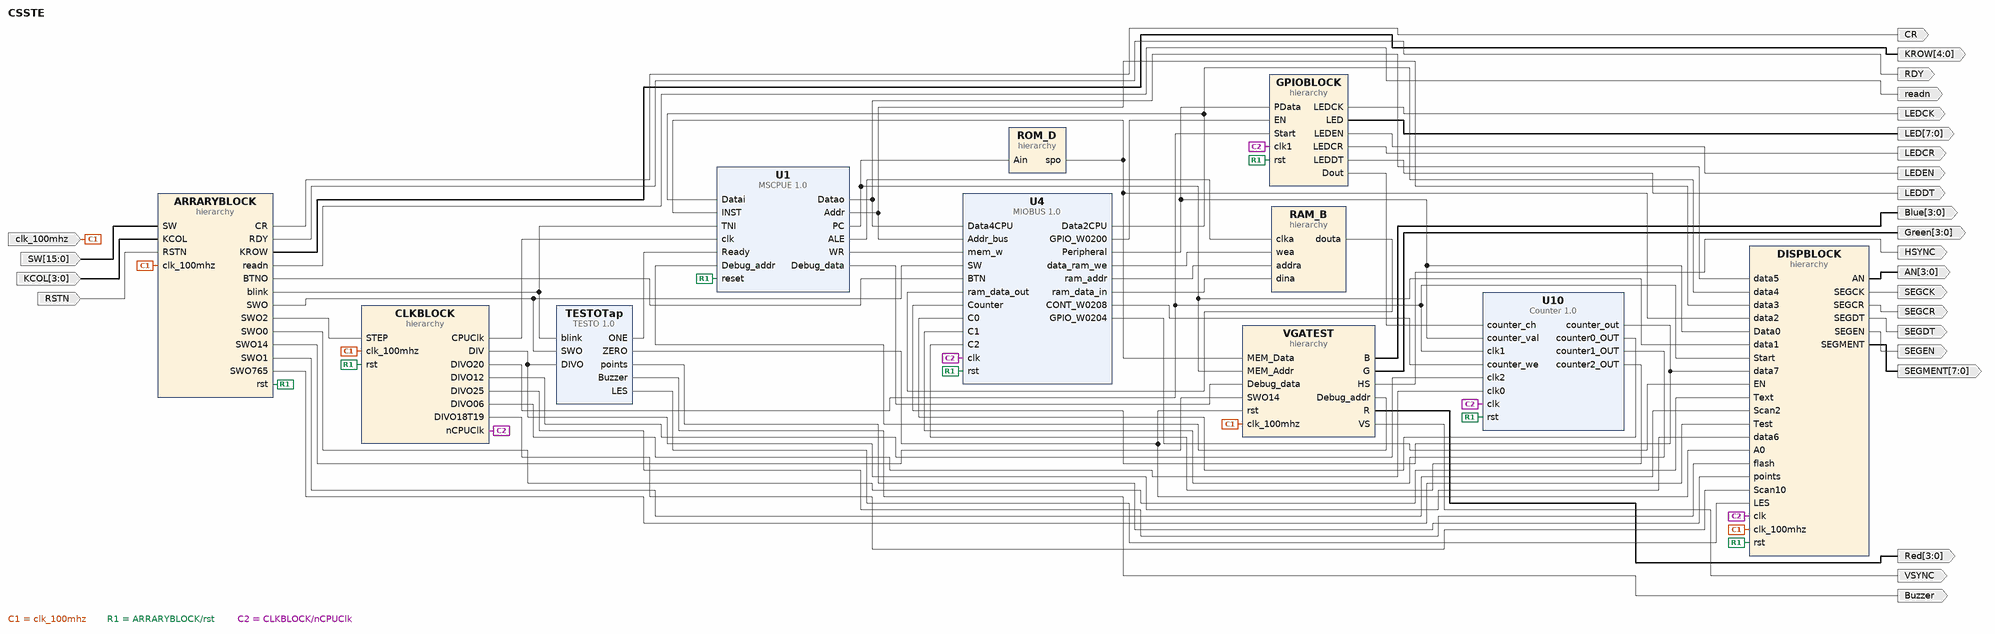
[diagram p0: block diagram of the top level]
# Vivado block design CSSTE, xc7k160tffg676-2L, Vivado 2017.4
create_bd_design CSSTE

create_bd_port -dir O CR
create_bd_port -dir O RDY
create_bd_port -dir I -from 15 -to 0 SW
create_bd_port -dir I -type clk clk_100mhz
create_bd_port -dir I -from 3 -to 0 KCOL
create_bd_port -dir O -from 4 -to 0 KROW
create_bd_port -dir I RSTN
create_bd_port -dir O readn
create_bd_port -dir O SEGEN
create_bd_port -dir O SEGCK
create_bd_port -dir O SEGCR
create_bd_port -dir O SEGDT
create_bd_port -dir O -from 3 -to 0 AN
create_bd_port -dir O -from 7 -to 0 SEGMENT
create_bd_port -dir O LEDEN
create_bd_port -dir O LEDCK
create_bd_port -dir O LEDCR
create_bd_port -dir O LEDDT
create_bd_port -dir O -from 7 -to 0 LED
create_bd_port -dir O -from 3 -to 0 Blue
create_bd_port -dir O -from 3 -to 0 Green
create_bd_port -dir O HSYNC
create_bd_port -dir O -from 3 -to 0 Red
create_bd_port -dir O VSYNC
create_bd_port -dir O Buzzer

create_bd_cell -type ip -vlnv ZJUCLIP:user:MSCPUE:1.0 U1
create_bd_cell -type ip -vlnv ZJUCLIP:user:MIOBUS:1.0 U4
create_bd_cell -type hier ARRARYBLOCK
create_bd_cell -type hier CLKBLOCK
create_bd_cell -type hier DISPBLOCK
create_bd_cell -type hier GPIOBLOCK
create_bd_cell -type hier ROM_D
create_bd_cell -type hier RAM_B
create_bd_cell -type ip -vlnv ZJUCLIP:user:TESTO:1.0 TESTOTap
create_bd_cell -type hier VGATEST
create_bd_cell -type ip -vlnv ZJUCLIP:user:Counter:1.0 U10

# ---- hierarchy /ARRARYBLOCK ----
current_bd_instance /ARRARYBLOCK
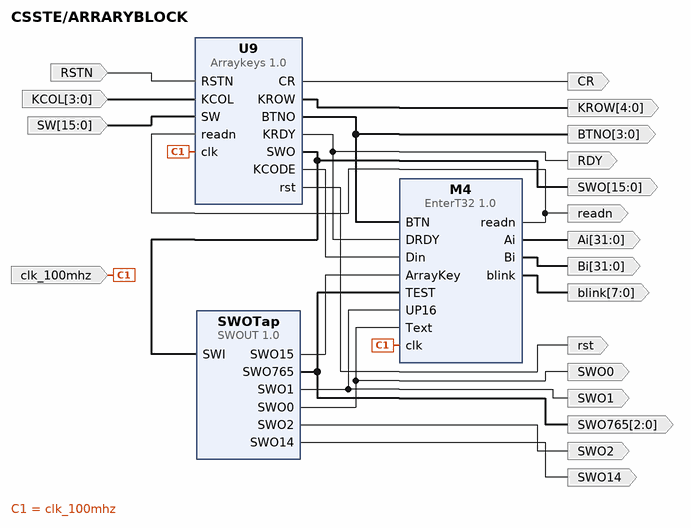
[diagram p1: block diagram inside /ARRARYBLOCK]
create_bd_pin -dir I -type clk clk_100mhz
create_bd_pin -dir I RSTN
create_bd_pin -dir O readn
create_bd_pin -dir I -from 3 -to 0 KCOL
create_bd_pin -dir O -from 4 -to 0 KROW
create_bd_pin -dir I -from 15 -to 0 SW
create_bd_pin -dir O RDY
create_bd_pin -dir O -from 3 -to 0 BTNO
create_bd_pin -dir O -from 15 -to 0 SWO
create_bd_pin -dir O CR
create_bd_pin -dir O rst
create_bd_pin -dir O -from 2 -to 0 SWO765
create_bd_pin -dir O SWO1
create_bd_pin -dir O SWO0
create_bd_pin -dir O -from 31 -to 0 Ai
create_bd_pin -dir O -from 31 -to 0 Bi
create_bd_pin -dir O -from 7 -to 0 blink
create_bd_pin -dir O SWO14
create_bd_pin -dir O SWO2

create_bd_cell -type ip -vlnv ZJUCLIP:user:Arraykeys:1.0 U9
create_bd_cell -type ip -vlnv ZJUCLIP:user:EnterT32:1.0 M4
create_bd_cell -type ip -vlnv ZJUCLIP:user:SWOUT:1.0 SWOTap

# ---- hierarchy /CLKBLOCK ----
current_bd_instance /CLKBLOCK
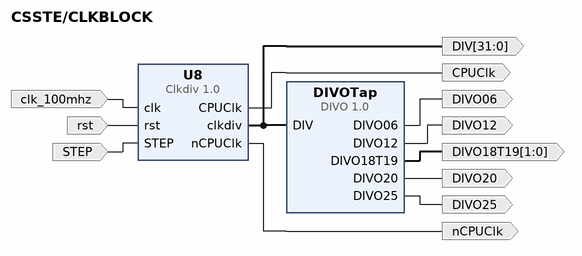
[diagram p2: block diagram inside /CLKBLOCK]
create_bd_pin -dir I -type clk clk_100mhz
create_bd_pin -dir I -type rst rst
create_bd_pin -dir I STEP
create_bd_pin -dir O -from 31 -to 0 DIV
create_bd_pin -dir O CPUClk
create_bd_pin -dir O nCPUClk
create_bd_pin -dir O DIVO25
create_bd_pin -dir O DIVO20
create_bd_pin -dir O -from 1 -to 0 DIVO18T19
create_bd_pin -dir O DIVO12
create_bd_pin -dir O DIVO06

create_bd_cell -type ip -vlnv ZJUCLIP:user:Clkdiv:1.0 U8
create_bd_cell -type ip -vlnv ZJUCLIP:user:DIVO:1.0 DIVOTap

# ---- hierarchy /DISPBLOCK ----
current_bd_instance /DISPBLOCK
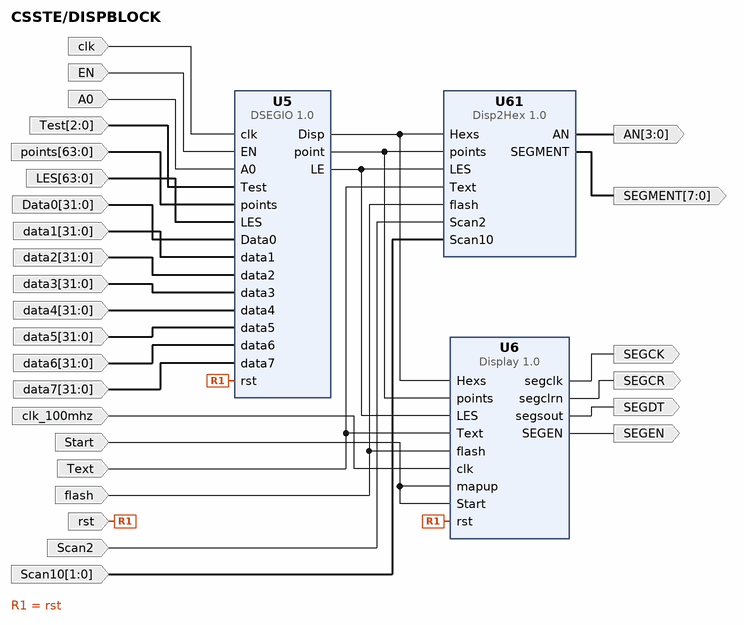
[diagram p3: block diagram inside /DISPBLOCK]
create_bd_pin -dir I clk
create_bd_pin -dir I rst
create_bd_pin -dir I EN
create_bd_pin -dir I A0
create_bd_pin -dir I -from 2 -to 0 Test
create_bd_pin -dir I -from 63 -to 0 points
create_bd_pin -dir I -from 63 -to 0 LES
create_bd_pin -dir I -from 31 -to 0 Data0
create_bd_pin -dir I -from 31 -to 0 data1
create_bd_pin -dir I -from 31 -to 0 data2
create_bd_pin -dir I -from 31 -to 0 data3
create_bd_pin -dir I -from 31 -to 0 data4
create_bd_pin -dir I -from 31 -to 0 data5
create_bd_pin -dir I -from 31 -to 0 data6
create_bd_pin -dir I -from 31 -to 0 data7
create_bd_pin -dir I -type clk clk_100mhz
create_bd_pin -dir I Start
create_bd_pin -dir I Text
create_bd_pin -dir I flash
create_bd_pin -dir O SEGCK
create_bd_pin -dir O SEGDT
create_bd_pin -dir O SEGEN
create_bd_pin -dir O SEGCR
create_bd_pin -dir I Scan2
create_bd_pin -dir I -from 1 -to 0 Scan10
create_bd_pin -dir O -from 3 -to 0 AN
create_bd_pin -dir O -from 7 -to 0 SEGMENT

create_bd_cell -type ip -vlnv ZJUCLIP:user:DSEGIO:1.0 U5
create_bd_cell -type ip -vlnv ZJUCLIP:user:Display:1.0 U6
create_bd_cell -type ip -vlnv ZJUCLIP:user:Disp2Hex:1.0 U61

# ---- hierarchy /GPIOBLOCK ----
current_bd_instance /GPIOBLOCK
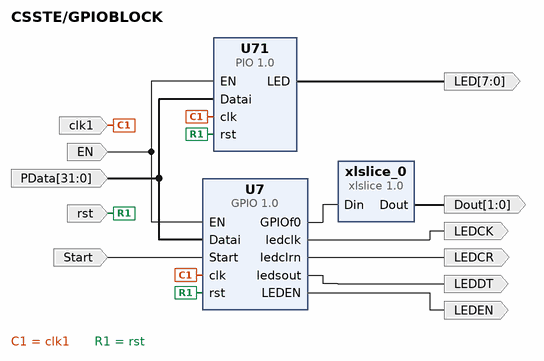
[diagram p4: block diagram inside /GPIOBLOCK]
create_bd_pin -dir I clk1
create_bd_pin -dir I rst
create_bd_pin -dir I EN
create_bd_pin -dir I -from 31 -to 0 PData
create_bd_pin -dir O -from 7 -to 0 LED
create_bd_pin -dir I Start
create_bd_pin -dir O LEDCK
create_bd_pin -dir O LEDDT
create_bd_pin -dir O LEDCR
create_bd_pin -dir O LEDEN
create_bd_pin -dir O -from 1 -to 0 Dout

create_bd_cell -type ip -vlnv ZJUCLIP:user:PIO:1.0 U71
create_bd_cell -type ip -vlnv ZJUCLIP:user:GPIO:1.0 U7
create_bd_cell -type ip -vlnv xilinx.com:ip:xlslice:1.0 xlslice_0
set_property -dict {CONFIG.DIN_TO 0 CONFIG.DIN_FROM 1 CONFIG.DIN_WIDTH 16 CONFIG.DOUT_WIDTH 2} [get_bd_cells xlslice_0]

# ---- hierarchy /ROM_D ----
current_bd_instance /ROM_D
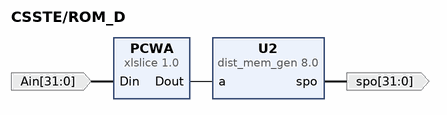
[diagram p5: block diagram inside /ROM_D]
create_bd_pin -dir I -from 31 -to 0 Ain
create_bd_pin -dir O -from 31 -to 0 spo

create_bd_cell -type ip -vlnv xilinx.com:ip:xlslice:1.0 PCWA
set_property -dict {CONFIG.DIN_TO 2 CONFIG.DIN_FROM 11 CONFIG.DOUT_WIDTH 10} [get_bd_cells PCWA]
create_bd_cell -type ip -vlnv xilinx.com:ip:dist_mem_gen:8.0 U2
set_property -dict [list \
  CONFIG.depth 1024 \
  CONFIG.data_width 32 \
  CONFIG.memory_type rom \
  CONFIG.coefficient_file ../../../../../../coe/MSCPUE31_sign.coe \
] [get_bd_cells U2]

# ---- hierarchy /RAM_B ----
current_bd_instance /RAM_B
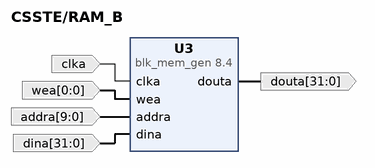
[diagram p6: block diagram inside /RAM_B]
create_bd_pin -dir I -type clk clka
create_bd_pin -dir I -from 0 -to 0 wea
create_bd_pin -dir I -from 9 -to 0 addra
create_bd_pin -dir I -from 31 -to 0 dina
create_bd_pin -dir O -from 31 -to 0 douta

create_bd_cell -type ip -vlnv xilinx.com:ip:blk_mem_gen:8.4 U3
set_property -dict [list \
  CONFIG.Enable_32bit_Address false \
  CONFIG.Use_Byte_Write_Enable false \
  CONFIG.Write_Depth_A 1024 \
  CONFIG.Enable_A Always_Enabled \
  CONFIG.Register_PortA_Output_of_Memory_Primitives false \
  CONFIG.Load_Init_File true \
  CONFIG.Coe_File ../../../../../../coe/D_mem.coe \
  CONFIG.Use_RSTA_Pin false \
  CONFIG.use_bram_block Stand_Alone \
] [get_bd_cells U3]

# ---- hierarchy /VGATEST ----
current_bd_instance /VGATEST
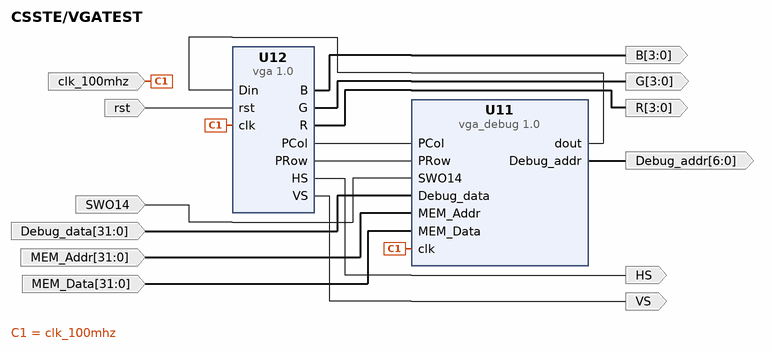
[diagram p7: block diagram inside /VGATEST]
create_bd_pin -dir I -type clk clk_100mhz
create_bd_pin -dir I SWO14
create_bd_pin -dir I -from 31 -to 0 Debug_data
create_bd_pin -dir I -from 31 -to 0 MEM_Addr
create_bd_pin -dir I -from 31 -to 0 MEM_Data
create_bd_pin -dir O -from 6 -to 0 Debug_addr
create_bd_pin -dir I -type rst rst
create_bd_pin -dir O -from 3 -to 0 R
create_bd_pin -dir O -from 3 -to 0 G
create_bd_pin -dir O -from 3 -to 0 B
create_bd_pin -dir O HS
create_bd_pin -dir O VS

create_bd_cell -type ip -vlnv ZJUCLIP:user:vga_debug:1.0 U11
create_bd_cell -type ip -vlnv ZJUCLIP:user:vga:1.0 U12

# ---- connections ----

current_bd_instance /ARRARYBLOCK
connect_bd_net [get_bd_pins U9/KCODE] [get_bd_pins M4/Din]
connect_bd_net [get_bd_pins SWOTap/SWO15] [get_bd_pins M4/ArrayKey]
connect_bd_net -net clk_0_1 [get_bd_pins clk_100mhz] [get_bd_pins M4/clk] [get_bd_pins U9/clk]
connect_bd_net -net RSTN_0_1 [get_bd_pins RSTN] [get_bd_pins U9/RSTN]
connect_bd_net [get_bd_pins M4/readn] [get_bd_pins readn] [get_bd_pins U9/readn]
connect_bd_net -net KCOL_0_1 [get_bd_pins KCOL] [get_bd_pins U9/KCOL]
connect_bd_net [get_bd_pins U9/KROW] [get_bd_pins KROW]
connect_bd_net -net SW_0_1 [get_bd_pins SW] [get_bd_pins U9/SW]
connect_bd_net [get_bd_pins U9/KRDY] [get_bd_pins RDY] [get_bd_pins M4/DRDY]
connect_bd_net [get_bd_pins U9/BTNO] [get_bd_pins BTNO] [get_bd_pins M4/BTN]
connect_bd_net [get_bd_pins U9/SWO] [get_bd_pins SWO] [get_bd_pins SWOTap/SWI]
connect_bd_net [get_bd_pins U9/CR] [get_bd_pins CR]
connect_bd_net [get_bd_pins U9/rst] [get_bd_pins rst]
connect_bd_net [get_bd_pins SWOTap/SWO765] [get_bd_pins SWO765] [get_bd_pins M4/TEST]
connect_bd_net [get_bd_pins SWOTap/SWO1] [get_bd_pins SWO1] [get_bd_pins M4/UP16]
connect_bd_net [get_bd_pins SWOTap/SWO0] [get_bd_pins SWO0] [get_bd_pins M4/Text]
connect_bd_net [get_bd_pins M4/Ai] [get_bd_pins Ai]
connect_bd_net [get_bd_pins M4/Bi] [get_bd_pins Bi]
connect_bd_net [get_bd_pins M4/blink] [get_bd_pins blink]
connect_bd_net [get_bd_pins SWOTap/SWO14] [get_bd_pins SWO14]
connect_bd_net [get_bd_pins SWOTap/SWO2] [get_bd_pins SWO2]

current_bd_instance /CLKBLOCK
connect_bd_net -net clk_0_2 [get_bd_pins clk_100mhz] [get_bd_pins U8/clk]
connect_bd_net -net rst_0_1 [get_bd_pins rst] [get_bd_pins U8/rst]
connect_bd_net -net STEP_0_1 [get_bd_pins STEP] [get_bd_pins U8/STEP]
connect_bd_net [get_bd_pins U8/clkdiv] [get_bd_pins DIV] [get_bd_pins DIVOTap/DIV]
connect_bd_net [get_bd_pins U8/CPUClk] [get_bd_pins CPUClk]
connect_bd_net [get_bd_pins U8/nCPUClk] [get_bd_pins nCPUClk]
connect_bd_net [get_bd_pins DIVOTap/DIVO25] [get_bd_pins DIVO25]
connect_bd_net [get_bd_pins DIVOTap/DIVO20] [get_bd_pins DIVO20]
connect_bd_net [get_bd_pins DIVOTap/DIVO18T19] [get_bd_pins DIVO18T19]
connect_bd_net [get_bd_pins DIVOTap/DIVO12] [get_bd_pins DIVO12]
connect_bd_net [get_bd_pins DIVOTap/DIVO06] [get_bd_pins DIVO06]

current_bd_instance /DISPBLOCK
connect_bd_net [get_bd_pins U5/Disp] [get_bd_pins U61/Hexs] [get_bd_pins U6/Hexs]
connect_bd_net [get_bd_pins U5/point] [get_bd_pins U61/points] [get_bd_pins U6/points]
connect_bd_net [get_bd_pins U5/LE] [get_bd_pins U61/LES] [get_bd_pins U6/LES]
connect_bd_net -net clk_1_1 [get_bd_pins clk] [get_bd_pins U5/clk]
connect_bd_net -net rst_1_1 [get_bd_pins rst] [get_bd_pins U6/rst] [get_bd_pins U5/rst]
connect_bd_net -net EN_0_1 [get_bd_pins EN] [get_bd_pins U5/EN]
connect_bd_net -net A0_0_1 [get_bd_pins A0] [get_bd_pins U5/A0]
connect_bd_net -net Test_0_1 [get_bd_pins Test] [get_bd_pins U5/Test]
connect_bd_net -net points_0_1 [get_bd_pins points] [get_bd_pins U5/points]
connect_bd_net -net LES_0_1 [get_bd_pins LES] [get_bd_pins U5/LES]
connect_bd_net -net Data0_0_1 [get_bd_pins Data0] [get_bd_pins U5/Data0]
connect_bd_net -net data1_0_1 [get_bd_pins data1] [get_bd_pins U5/data1]
connect_bd_net -net data2_0_1 [get_bd_pins data2] [get_bd_pins U5/data2]
connect_bd_net -net data3_0_1 [get_bd_pins data3] [get_bd_pins U5/data3]
connect_bd_net -net data4_0_1 [get_bd_pins data4] [get_bd_pins U5/data4]
connect_bd_net -net data5_0_1 [get_bd_pins data5] [get_bd_pins U5/data5]
connect_bd_net -net data6_0_1 [get_bd_pins data6] [get_bd_pins U5/data6]
connect_bd_net -net data7_0_1 [get_bd_pins data7] [get_bd_pins U5/data7]
connect_bd_net -net clk_2_1 [get_bd_pins clk_100mhz] [get_bd_pins U6/clk]
connect_bd_net -net Start_0_1 [get_bd_pins Start] [get_bd_pins U6/mapup] [get_bd_pins U6/Start]
connect_bd_net -net Text_0_1 [get_bd_pins Text] [get_bd_pins U61/Text] [get_bd_pins U6/Text]
connect_bd_net -net flash_0_1 [get_bd_pins flash] [get_bd_pins U61/flash] [get_bd_pins U6/flash]
connect_bd_net [get_bd_pins U6/segclk] [get_bd_pins SEGCK]
connect_bd_net [get_bd_pins U6/segsout] [get_bd_pins SEGDT]
connect_bd_net [get_bd_pins U6/SEGEN] [get_bd_pins SEGEN]
connect_bd_net [get_bd_pins U6/segclrn] [get_bd_pins SEGCR]
connect_bd_net -net Scan2_0_1 [get_bd_pins Scan2] [get_bd_pins U61/Scan2]
connect_bd_net -net Scan10_0_1 [get_bd_pins Scan10] [get_bd_pins U61/Scan10]
connect_bd_net [get_bd_pins U61/AN] [get_bd_pins AN]
connect_bd_net [get_bd_pins U61/SEGMENT] [get_bd_pins SEGMENT]

current_bd_instance /GPIOBLOCK
connect_bd_net [get_bd_pins U7/GPIOf0] [get_bd_pins xlslice_0/Din]
connect_bd_net -net clk_3_1 [get_bd_pins clk1] [get_bd_pins U7/clk] [get_bd_pins U71/clk]
connect_bd_net -net rst_2_1 [get_bd_pins rst] [get_bd_pins U7/rst] [get_bd_pins U71/rst]
connect_bd_net -net EN_1_1 [get_bd_pins EN] [get_bd_pins U7/EN] [get_bd_pins U71/EN]
connect_bd_net -net Datai_0_1 [get_bd_pins PData] [get_bd_pins U7/Datai] [get_bd_pins U71/Datai]
connect_bd_net [get_bd_pins U71/LED] [get_bd_pins LED]
connect_bd_net -net Start_0_2 [get_bd_pins Start] [get_bd_pins U7/Start]
connect_bd_net [get_bd_pins U7/ledclk] [get_bd_pins LEDCK]
connect_bd_net [get_bd_pins U7/ledsout] [get_bd_pins LEDDT]
connect_bd_net [get_bd_pins U7/ledclrn] [get_bd_pins LEDCR]
connect_bd_net [get_bd_pins U7/LEDEN] [get_bd_pins LEDEN]
connect_bd_net [get_bd_pins xlslice_0/Dout] [get_bd_pins Dout]

current_bd_instance /ROM_D
connect_bd_net [get_bd_pins PCWA/Dout] [get_bd_pins U2/a]
connect_bd_net -net Din_0_1 [get_bd_pins Ain] [get_bd_pins PCWA/Din]
connect_bd_net -net ROM_D_spo [get_bd_pins U2/spo] [get_bd_pins spo]

current_bd_instance /RAM_B
connect_bd_net -net clka_0_1 [get_bd_pins clka] [get_bd_pins U3/clka]
connect_bd_net -net wea_0_1 [get_bd_pins wea] [get_bd_pins U3/wea]
connect_bd_net -net addra_0_1 [get_bd_pins addra] [get_bd_pins U3/addra]
connect_bd_net -net dina_0_1 [get_bd_pins dina] [get_bd_pins U3/dina]
connect_bd_net -net RAM_B_douta [get_bd_pins U3/douta] [get_bd_pins douta]

current_bd_instance /VGATEST
connect_bd_net [get_bd_pins U12/PCol] [get_bd_pins U11/PCol]
connect_bd_net [get_bd_pins U12/PRow] [get_bd_pins U11/PRow]
connect_bd_net [get_bd_pins U11/dout] [get_bd_pins U12/Din]
connect_bd_net -net clk_4_1 [get_bd_pins clk_100mhz] [get_bd_pins U12/clk] [get_bd_pins U11/clk]
connect_bd_net -net SWO14_0_1 [get_bd_pins SWO14] [get_bd_pins U11/SWO14]
connect_bd_net -net Debug_data_0_1 [get_bd_pins Debug_data] [get_bd_pins U11/Debug_data]
connect_bd_net -net MEM_Addr_0_1 [get_bd_pins MEM_Addr] [get_bd_pins U11/MEM_Addr]
connect_bd_net -net MEM_Data_0_1 [get_bd_pins MEM_Data] [get_bd_pins U11/MEM_Data]
connect_bd_net [get_bd_pins U11/Debug_addr] [get_bd_pins Debug_addr]
connect_bd_net -net rst_3_1 [get_bd_pins rst] [get_bd_pins U12/rst]
connect_bd_net [get_bd_pins U12/R] [get_bd_pins R]
connect_bd_net [get_bd_pins U12/G] [get_bd_pins G]
connect_bd_net [get_bd_pins U12/B] [get_bd_pins B]
connect_bd_net [get_bd_pins U12/HS] [get_bd_pins HS]
connect_bd_net [get_bd_pins U12/VS] [get_bd_pins VS]

current_bd_instance /
connect_bd_net -net U9_CR [get_bd_pins ARRARYBLOCK/CR] [get_bd_ports CR]
connect_bd_net -net U9_KRDY [get_bd_pins ARRARYBLOCK/RDY] [get_bd_ports RDY]
connect_bd_net -net SW_0_1 [get_bd_ports SW] [get_bd_pins ARRARYBLOCK/SW]
connect_bd_net -net clk_0_1 [get_bd_ports clk_100mhz] \
  [get_bd_pins ARRARYBLOCK/clk_100mhz] [get_bd_pins CLKBLOCK/clk_100mhz] [get_bd_pins VGATEST/clk_100mhz] \
  [get_bd_pins DISPBLOCK/clk_100mhz]
connect_bd_net -net KCOL_0_1 [get_bd_ports KCOL] [get_bd_pins ARRARYBLOCK/KCOL]
connect_bd_net -net U9_KROW [get_bd_pins ARRARYBLOCK/KROW] [get_bd_ports KROW]
connect_bd_net -net RSTN_0_1 [get_bd_ports RSTN] [get_bd_pins ARRARYBLOCK/RSTN]
connect_bd_net -net M4_readn [get_bd_pins ARRARYBLOCK/readn] [get_bd_ports readn]
connect_bd_net -net U6_SEGEN [get_bd_pins DISPBLOCK/SEGEN] [get_bd_ports SEGEN]
connect_bd_net -net U6_segclk [get_bd_pins DISPBLOCK/SEGCK] [get_bd_ports SEGCK]
connect_bd_net -net U6_segclrn [get_bd_pins DISPBLOCK/SEGCR] [get_bd_ports SEGCR]
connect_bd_net -net U6_segsout [get_bd_pins DISPBLOCK/SEGDT] [get_bd_ports SEGDT]
connect_bd_net -net U61_AN [get_bd_pins DISPBLOCK/AN] [get_bd_ports AN]
connect_bd_net -net U61_SEGMENT [get_bd_pins DISPBLOCK/SEGMENT] [get_bd_ports SEGMENT]
connect_bd_net -net U7_LEDEN [get_bd_pins GPIOBLOCK/LEDEN] [get_bd_ports LEDEN]
connect_bd_net -net U7_ledclk [get_bd_pins GPIOBLOCK/LEDCK] [get_bd_ports LEDCK]
connect_bd_net -net U7_ledclrn [get_bd_pins GPIOBLOCK/LEDCR] [get_bd_ports LEDCR]
connect_bd_net -net U7_ledsout [get_bd_pins GPIOBLOCK/LEDDT] [get_bd_ports LEDDT]
connect_bd_net -net U71_LED [get_bd_pins GPIOBLOCK/LED] [get_bd_ports LED]
connect_bd_net [get_bd_pins U4/Data2CPU] [get_bd_pins U1/Datai] [get_bd_pins DISPBLOCK/data4]
connect_bd_net [get_bd_pins U1/Datao] [get_bd_pins U4/Data4CPU] [get_bd_pins DISPBLOCK/data5]
connect_bd_net [get_bd_pins U1/Addr] [get_bd_pins U4/Addr_bus] [get_bd_pins DISPBLOCK/data3]
connect_bd_net [get_bd_pins U1/WR] [get_bd_pins U4/mem_w]
connect_bd_net -net U12_B [get_bd_pins VGATEST/B] [get_bd_ports Blue]
connect_bd_net -net U12_G [get_bd_pins VGATEST/G] [get_bd_ports Green]
connect_bd_net -net U12_HS [get_bd_pins VGATEST/HS] [get_bd_ports HSYNC]
connect_bd_net -net U12_R [get_bd_pins VGATEST/R] [get_bd_ports Red]
connect_bd_net -net U12_VS [get_bd_pins VGATEST/VS] [get_bd_ports VSYNC]
connect_bd_net [get_bd_pins ARRARYBLOCK/blink] [get_bd_pins U1/TNI] [get_bd_pins TESTOTap/blink]
connect_bd_net [get_bd_pins ARRARYBLOCK/rst] \
  [get_bd_pins U1/reset] [get_bd_pins U4/rst] [get_bd_pins U10/rst] [get_bd_pins GPIOBLOCK/rst] [get_bd_pins DISPBLOCK/rst] \
  [get_bd_pins CLKBLOCK/rst]
connect_bd_net [get_bd_pins ARRARYBLOCK/SWO] [get_bd_pins U4/SW] [get_bd_pins TESTOTap/SWO]
connect_bd_net [get_bd_pins ARRARYBLOCK/BTNO] [get_bd_pins U4/BTN]
connect_bd_net [get_bd_pins ARRARYBLOCK/SWO0] [get_bd_pins DISPBLOCK/Text]
connect_bd_net [get_bd_pins ARRARYBLOCK/SWO1] [get_bd_pins DISPBLOCK/Scan2]
connect_bd_net -net STEP_1 [get_bd_pins ARRARYBLOCK/SWO2] [get_bd_pins CLKBLOCK/STEP]
connect_bd_net [get_bd_pins ARRARYBLOCK/SWO765] [get_bd_pins DISPBLOCK/Test]
connect_bd_net [get_bd_pins ARRARYBLOCK/SWO14] [get_bd_pins VGATEST/SWO14]
connect_bd_net [get_bd_pins CLKBLOCK/DIV] [get_bd_pins TESTOTap/DIVO] [get_bd_pins DISPBLOCK/data6]
connect_bd_net [get_bd_pins CLKBLOCK/DIVO25] [get_bd_pins DISPBLOCK/flash]
connect_bd_net [get_bd_pins CLKBLOCK/DIVO18T19] [get_bd_pins DISPBLOCK/Scan10]
connect_bd_net [get_bd_pins CLKBLOCK/CPUClk] [get_bd_pins U1/clk]
connect_bd_net [get_bd_pins CLKBLOCK/DIVO12] [get_bd_pins U10/clk2]
connect_bd_net [get_bd_pins CLKBLOCK/DIVO20] [get_bd_pins U10/clk1] [get_bd_pins GPIOBLOCK/Start] [get_bd_pins DISPBLOCK/Start]
connect_bd_net [get_bd_pins CLKBLOCK/DIVO06] [get_bd_pins U10/clk0]
connect_bd_net [get_bd_pins CLKBLOCK/nCPUClk] [get_bd_pins U10/clk] [get_bd_pins U4/clk] [get_bd_pins GPIOBLOCK/clk1] [get_bd_pins DISPBLOCK/clk]
connect_bd_net [get_bd_pins ROM_D/spo] [get_bd_pins U1/INST] [get_bd_pins VGATEST/MEM_Data] [get_bd_pins DISPBLOCK/data2]
connect_bd_net [get_bd_pins U1/PC] [get_bd_pins ROM_D/Ain] [get_bd_pins DISPBLOCK/data1] [get_bd_pins VGATEST/MEM_Addr]
connect_bd_net [get_bd_pins TESTOTap/ONE] [get_bd_pins U1/Ready]
connect_bd_net [get_bd_pins VGATEST/Debug_addr] [get_bd_pins U1/Debug_addr]
connect_bd_net [get_bd_pins U1/Debug_data] [get_bd_pins VGATEST/Debug_data]
connect_bd_net [get_bd_pins U1/ALE] [get_bd_pins RAM_B/clka]
connect_bd_net -net wea_1 [get_bd_pins U4/data_ram_we] [get_bd_pins RAM_B/wea]
connect_bd_net -net addra_1 [get_bd_pins U4/ram_addr] [get_bd_pins RAM_B/addra]
connect_bd_net [get_bd_pins U4/ram_data_in] [get_bd_pins RAM_B/dina]
connect_bd_net [get_bd_pins RAM_B/douta] [get_bd_pins U4/ram_data_out]
connect_bd_net [get_bd_pins TESTOTap/Buzzer] [get_bd_ports Buzzer]
connect_bd_net [get_bd_pins TESTOTap/points] [get_bd_pins DISPBLOCK/points]
connect_bd_net [get_bd_pins TESTOTap/LES] [get_bd_pins DISPBLOCK/LES]
connect_bd_net [get_bd_pins TESTOTap/ZERO] [get_bd_pins DISPBLOCK/A0] [get_bd_pins VGATEST/rst]
connect_bd_net [get_bd_pins U4/GPIO_W0200] [get_bd_pins GPIOBLOCK/EN]
connect_bd_net [get_bd_pins U4/GPIO_W0204] [get_bd_pins DISPBLOCK/EN]
connect_bd_net [get_bd_pins U4/CONT_W0208] [get_bd_pins U10/counter_we]
connect_bd_net [get_bd_pins U4/Peripheral] [get_bd_pins U10/counter_val] [get_bd_pins GPIOBLOCK/PData] [get_bd_pins DISPBLOCK/Data0]
connect_bd_net [get_bd_pins U10/counter_out] [get_bd_pins U4/Counter] [get_bd_pins DISPBLOCK/data7]
connect_bd_net [get_bd_pins U10/counter0_OUT] [get_bd_pins U4/C0]
connect_bd_net [get_bd_pins U10/counter1_OUT] [get_bd_pins U4/C1]
connect_bd_net [get_bd_pins U10/counter2_OUT] [get_bd_pins U4/C2]
connect_bd_net [get_bd_pins GPIOBLOCK/Dout] [get_bd_pins U10/counter_ch]

validate_bd_design
save_bd_design
